# EAGLE design clock (EAGLE 6.5.0)
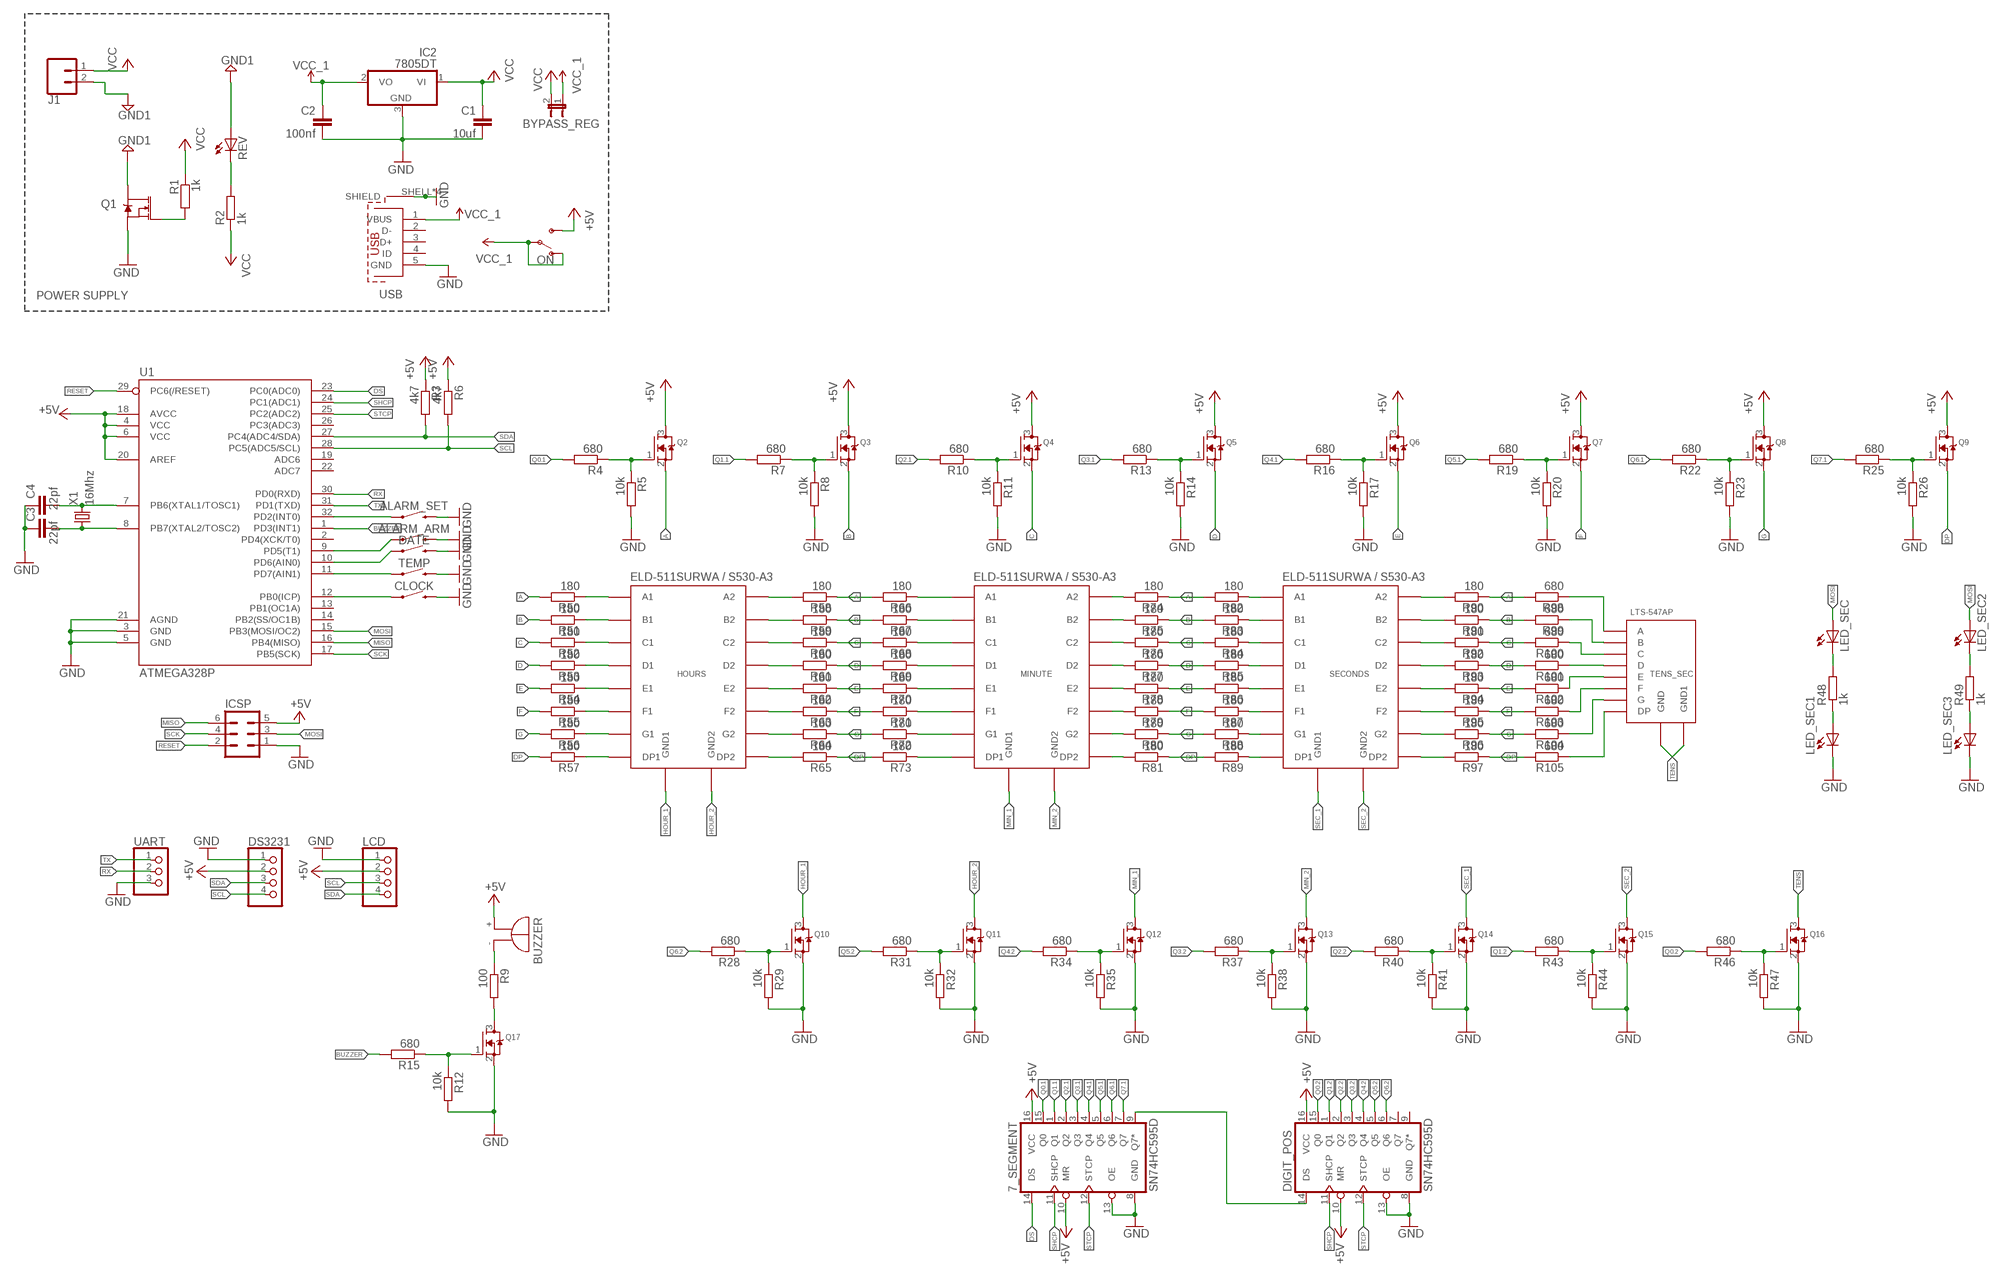
[diagram p0: schematic, sheet 1]

## Parts
7_SEGMENT  SN74HC595D  74HC595D  [SO16]
ALARM_ARM  MOMENTARY-SWITCH-SPST-SMD-5.2MM  [TACTILE_SWITCH_SMD_5.2MM]
ALARM_SET  MOMENTARY-SWITCH-SPST-SMD-5.2MM  [TACTILE_SWITCH_SMD_5.2MM]
BUZZER  EB2209A  [EB2209A]
BYPASS_REG  JUMPER-2PTH  [1X02]
C1  10uf  C-EUC1206  [C1206]
C2  100nf  C-EUC1206  [C1206]
C3  22pf  C-EUC1206  [C1206]
C4  22pf  C-EUC1206  [C1206]
CLOCK  MOMENTARY-SWITCH-SPST-SMD-5.2MM  [TACTILE_SWITCH_SMD_5.2MM]
DATE  MOMENTARY-SWITCH-SPST-SMD-5.2MM  [TACTILE_SWITCH_SMD_5.2MM]
DIGIT_POS  SN74HC595D  74HC595D  [SO16]
DS3231  PINHD-1X4  [1X04]
HOURS  ELD-511SURWA/S530-A3  [2_DIGITS_7_SEGMENT]
IC2  7805DT  [TO252]
ICSP  MA03-2  [MA03-2]
J1  CONN_025MM  [SCREWTERMINAL-5MM-2]
LCD  PINHD-1X4  [1X04]
LED_SEC  LEDSML0805  [SML0805]
LED_SEC1  LEDSML0805  [SML0805]
LED_SEC2  LEDSML0805  [SML0805]
LED_SEC3  LEDSML0805  [SML0805]
MINUTE  ELD-511SURWA/S530-A3  [2_DIGITS_7_SEGMENT]
ON  SWITCH-SPDT-PTH-11.6X4.0MM  [SWITCH_SPDT_PTH_11.6X4.0MM]
Q1  MOSFET-NCH-FDD8780  [DPAK]
Q2  MOSFET-NREFLOW  [SOT23]
Q3  MOSFET-NREFLOW  [SOT23]
Q4  MOSFET-NREFLOW  [SOT23]
Q5  MOSFET-NREFLOW  [SOT23]
Q6  MOSFET-NREFLOW  [SOT23]
Q7  MOSFET-NREFLOW  [SOT23]
Q8  MOSFET-NREFLOW  [SOT23]
Q9  MOSFET-NREFLOW  [SOT23]
Q10  MOSFET-NREFLOW  [SOT23]
Q11  MOSFET-NREFLOW  [SOT23]
Q12  MOSFET-NREFLOW  [SOT23]
Q13  MOSFET-NREFLOW  [SOT23]
Q14  MOSFET-NREFLOW  [SOT23]
Q15  MOSFET-NREFLOW  [SOT23]
Q16  MOSFET-NREFLOW  [SOT23]
Q17  MOSFET-NREFLOW  [SOT23]
R1  1k  R-EU_R0805  [R0805]
R2  1k  R-EU_M0805  [M0805]
R3  4k7  R-EU_M0805  [M0805]
R4  680  R-EU_M0805  [M0805]
R5  10k  R-EU_M0805  [M0805]
R6  4k7  R-EU_M0805  [M0805]
R7  680  R-EU_M0805  [M0805]
R8  10k  R-EU_M0805  [M0805]
R9  100  R-EU_M0805  [M0805]
R10  680  R-EU_M0805  [M0805]
R11  10k  R-EU_M0805  [M0805]
R12  10k  R-EU_M0805  [M0805]
R13  680  R-EU_M0805  [M0805]
R14  10k  R-EU_M0805  [M0805]
R15  680  R-EU_M0805  [M0805]
R16  680  R-EU_M0805  [M0805]
R17  10k  R-EU_M0805  [M0805]
R19  680  R-EU_M0805  [M0805]
R20  10k  R-EU_M0805  [M0805]
R22  680  R-EU_M0805  [M0805]
R23  10k  R-EU_M0805  [M0805]
R25  680  R-EU_M0805  [M0805]
R26  10k  R-EU_M0805  [M0805]
R28  680  R-EU_M0805  [M0805]
R29  10k  R-EU_M0805  [M0805]
R31  680  R-EU_M0805  [M0805]
R32  10k  R-EU_M0805  [M0805]
R34  680  R-EU_M0805  [M0805]
R35  10k  R-EU_M0805  [M0805]
R37  680  R-EU_M0805  [M0805]
R38  10k  R-EU_M0805  [M0805]
R40  680  R-EU_M0805  [M0805]
R41  10k  R-EU_M0805  [M0805]
R43  680  R-EU_M0805  [M0805]
R44  10k  R-EU_M0805  [M0805]
R46  680  R-EU_M0805  [M0805]
R47  10k  R-EU_M0805  [M0805]
R48  1k  R-EU_M0805  [M0805]
R49  1k  R-EU_M0805  [M0805]
R50  180  R-EU_M0805  [M0805]
R51  180  R-EU_M0805  [M0805]
R52  180  R-EU_M0805  [M0805]
R53  180  R-EU_M0805  [M0805]
R54  180  R-EU_M0805  [M0805]
R55  180  R-EU_M0805  [M0805]
R56  180  R-EU_M0805  [M0805]
R57  180  R-EU_M0805  [M0805]
R58  180  R-EU_M0805  [M0805]
R59  180  R-EU_M0805  [M0805]
R60  180  R-EU_M0805  [M0805]
R61  180  R-EU_M0805  [M0805]
R62  180  R-EU_M0805  [M0805]
R63  180  R-EU_M0805  [M0805]
R64  180  R-EU_M0805  [M0805]
R65  180  R-EU_M0805  [M0805]
R66  180  R-EU_M0805  [M0805]
R67  180  R-EU_M0805  [M0805]
R68  180  R-EU_M0805  [M0805]
R69  180  R-EU_M0805  [M0805]
R70  180  R-EU_M0805  [M0805]
R71  180  R-EU_M0805  [M0805]
R72  180  R-EU_M0805  [M0805]
R73  180  R-EU_M0805  [M0805]
R74  180  R-EU_M0805  [M0805]
R75  180  R-EU_M0805  [M0805]
R76  180  R-EU_M0805  [M0805]
R77  180  R-EU_M0805  [M0805]
R78  180  R-EU_M0805  [M0805]
R79  180  R-EU_M0805  [M0805]
R80  180  R-EU_M0805  [M0805]
R81  180  R-EU_M0805  [M0805]
R82  180  R-EU_M0805  [M0805]
R83  180  R-EU_M0805  [M0805]
R84  180  R-EU_M0805  [M0805]
R85  180  R-EU_M0805  [M0805]
R86  180  R-EU_M0805  [M0805]
R87  180  R-EU_M0805  [M0805]
R88  180  R-EU_M0805  [M0805]
R89  180  R-EU_M0805  [M0805]
R90  180  R-EU_M0805  [M0805]
R91  180  R-EU_M0805  [M0805]
R92  180  R-EU_M0805  [M0805]
R93  180  R-EU_M0805  [M0805]
R94  180  R-EU_M0805  [M0805]
R95  180  R-EU_M0805  [M0805]
R96  180  R-EU_M0805  [M0805]
R97  180  R-EU_M0805  [M0805]
R98  680  R-EU_M0805  [M0805]
R99  680  R-EU_M0805  [M0805]
R100  680  R-EU_M0805  [M0805]
R101  680  R-EU_M0805  [M0805]
R102  680  R-EU_M0805  [M0805]
R103  680  R-EU_M0805  [M0805]
R104  680  R-EU_M0805  [M0805]
R105  680  R-EU_M0805  [M0805]
REV  LEDSML0805  [SML0805]
SECONDS  ELD-511SURWA/S530-A3  [2_DIGITS_7_SEGMENT]
TEMP  MOMENTARY-SWITCH-SPST-SMD-5.2MM  [TACTILE_SWITCH_SMD_5.2MM]
TENS_SEC  LTS-547AP  [LTS-547AP]
U1  ATMEGA328P  ATMEGA328P_TQFP  [TQFP32-08]
UART  PINHD-1X3  [1X03]
USB  629105136821  [629105136821]
X1  16Mhz  CRYSTALSM49  [SM49]

## Nets
+5V: 7_SEGMENT.10(MR) 7_SEGMENT.16(VCC) BUZZER.+ DIGIT_POS.10(MR) DIGIT_POS.16(VCC) DS3231.2 ICSP.5 LCD.2 ON.3(S) Q2.3(D) Q3.3(D) Q4.3(D) Q5.3(D) Q6.3(D) Q7.3(D) Q8.3(D) Q9.3(D) R3.1 R6.1 U1.4(VCC) U1.6(VCC) U1.18(AVCC) U1.20(AREF)
A: Q2.2(S) R50.2 R58.1 R66.2 R74.1 R82.2 R90.1 R98.2
B: Q3.2(S) R51.2 R59.1 R67.2 R75.1 R83.2 R91.1 R99.2
BUZZER: R15.2 U1.1(PD3(INT1))
C: Q4.2(S) R52.2 R60.1 R68.2 R76.1 R84.2 R92.1 R100.2
D: Q5.2(S) R53.2 R61.1 R69.2 R77.1 R85.2 R93.1 R101.2
DP: Q9.2(S) R57.2 R65.1 R73.2 R81.1 R89.2 R97.1 R105.2
DS: 7_SEGMENT.14(DS) U1.23(PC0(ADC0))
E: Q6.2(S) R54.2 R62.1 R70.2 R78.1 R86.2 R94.1 R102.2
F: Q7.2(S) R55.2 R63.1 R71.2 R79.1 R87.2 R95.1 R103.2
G: Q8.2(S) R56.2 R64.1 R72.2 R80.1 R88.2 R96.1 R104.2
GND: 7_SEGMENT.8(GND) 7_SEGMENT.13(OE) ALARM_ARM.3 ALARM_SET.3 C1.2 C2.2 C3.1 C4.1 CLOCK.3 DATE.3 DIGIT_POS.8(GND) DIGIT_POS.13(OE) DS3231.1 IC2.3(GND) ICSP.1 LCD.1 LED_SEC1.C LED_SEC3.C Q1.3(S) Q10.2(S) Q11.2(S) Q12.2(S) Q13.2(S) Q14.2(S) Q15.2(S) Q16.2(S) Q17.2(S) R5.2 R8.2 R11.2 R12.2 R14.2 R17.2 R20.2 R23.2 R26.2 R29.2 R32.2 R35.2 R38.2 R41.2 R44.2 R47.2 TEMP.3 U1.3(GND) U1.5(GND) U1.21(AGND) UART.3 USB.5(GND) USB.SHELL1(SHIELD) USB.SHELL2(SHIELD) USB.SHELL3(SHIELD) USB.SHELL(SHIELD)
GND1: J1.2 Q1.4(D) REV.A
HOUR_1: HOURS.GND1 Q10.3(D)
HOUR_2: HOURS.GND2 Q11.3(D)
MIN_1: MINUTE.GND1 Q12.3(D)
MIN_2: MINUTE.GND2 Q13.3(D)
MISO: ICSP.6 U1.16(PB4(MISO))
MOSI: ICSP.3 LED_SEC2.A LED_SEC.A U1.15(PB3(MOSI/OC2))
N$1: Q1.1(G) R1.2
N$2: LED_SEC.C R48.2
N$3: C4.2 U1.7(PB6(XTAL1/TOSC1)) X1.2
N$4: C3.2 U1.8(PB7(XTAL2/TOSC2)) X1.1
N$5: 7_SEGMENT.9(Q7*) DIGIT_POS.14(DS)
N$6: Q2.1(G) R4.1 R5.1
N$7: R2.2 REV.C
N$8: Q3.1(G) R7.1 R8.1
N$9: Q4.1(G) R10.1 R11.1
N$10: Q5.1(G) R13.1 R14.1
N$11: Q6.1(G) R16.1 R17.1
N$12: Q7.1(G) R19.1 R20.1
N$13: Q8.1(G) R22.1 R23.1
N$14: Q9.1(G) R25.1 R26.1
N$15: Q10.1(G) R28.1 R29.1
N$16: CLOCK.1 U1.12(PB0(ICP))
N$17: TEMP.1 U1.11(PD7(AIN1))
N$18: DATE.1 U1.10(PD6(AIN0))
N$19: Q11.1(G) R31.1 R32.1
N$20: LED_SEC1.A R48.1
N$21: LED_SEC2.C R49.2
N$22: Q17.1(G) R12.1 R15.1
N$23: Q12.1(G) R34.1 R35.1
N$24: LED_SEC3.A R49.1
N$25: ALARM_SET.1 U1.32(PD2(INT0))
N$26: HOURS.A1 R50.1
N$27: Q13.1(G) R37.1 R38.1
N$28: HOURS.B1 R51.1
N$29: ALARM_ARM.1 U1.9(PD5(T1))
N$30: HOURS.C1 R52.1
N$31: Q14.1(G) R40.1 R41.1
N$32: HOURS.D1 R53.1
N$33: HOURS.E1 R54.1
N$34: HOURS.F1 R55.1
N$35: Q15.1(G) R43.1 R44.1
N$36: HOURS.G1 R56.1
N$37: HOURS.DP1 R57.1
N$38: HOURS.A2 R58.2
N$39: Q16.1(G) R46.1 R47.1
N$40: HOURS.B2 R59.2
N$41: HOURS.C2 R60.2
N$42: HOURS.D2 R61.2
N$43: HOURS.E2 R62.2
N$44: HOURS.F2 R63.2
N$45: HOURS.G2 R64.2
N$46: HOURS.DP2 R65.2
N$47: MINUTE.A2 R74.2
N$48: MINUTE.A1 R66.1
N$49: MINUTE.B1 R67.1
N$50: MINUTE.C1 R68.1
N$51: MINUTE.B2 R75.2
N$52: MINUTE.C2 R76.2
N$53: MINUTE.D2 R77.2
N$54: MINUTE.E2 R78.2
N$55: MINUTE.F2 R79.2
N$56: MINUTE.G2 R80.2
N$57: MINUTE.DP2 R81.2
N$58: MINUTE.DP1 R73.1
N$59: MINUTE.G1 R72.1
N$60: MINUTE.F1 R71.1
N$61: MINUTE.E1 R70.1
N$62: MINUTE.D1 R69.1
N$63: Q17.3(D) R9.2
N$64: BUZZER.- R9.1
N$65: R89.1 SECONDS.DP1
N$66: R88.1 SECONDS.G1
N$67: R87.1 SECONDS.F1
N$68: R86.1 SECONDS.E1
N$75: R82.1 SECONDS.A1
N$76: R83.1 SECONDS.B1
N$77: R84.1 SECONDS.C1
N$78: R85.1 SECONDS.D1
N$79: R90.2 SECONDS.A2
N$80: R91.2 SECONDS.B2
N$81: R92.2 SECONDS.C2
N$82: R93.2 SECONDS.D2
N$83: R94.2 SECONDS.E2
N$84: R95.2 SECONDS.F2
N$85: R96.2 SECONDS.G2
N$86: R97.2 SECONDS.DP2
N$95: R98.1 TENS_SEC.A
N$96: R99.1 TENS_SEC.B
N$97: R100.1 TENS_SEC.C
N$98: R101.1 TENS_SEC.D
N$99: R102.1 TENS_SEC.E
N$100: R103.1 TENS_SEC.F
N$101: R104.1 TENS_SEC.G
N$102: R105.1 TENS_SEC.DP
Q0.1: 7_SEGMENT.15(Q0) R4.2
Q0.2: DIGIT_POS.15(Q0) R46.2
Q1.1: 7_SEGMENT.1(Q1) R7.2
Q1.2: DIGIT_POS.1(Q1) R43.2
Q2.1: 7_SEGMENT.2(Q2) R10.2
Q2.2: DIGIT_POS.2(Q2) R40.2
Q3.1: 7_SEGMENT.3(Q3) R13.2
Q3.2: DIGIT_POS.3(Q3) R37.2
Q4.1: 7_SEGMENT.4(Q4) R16.2
Q4.2: DIGIT_POS.4(Q4) R34.2
Q5.1: 7_SEGMENT.5(Q5) R19.2
Q5.2: DIGIT_POS.5(Q5) R31.2
Q6.1: 7_SEGMENT.6(Q6) R22.2
Q6.2: DIGIT_POS.6(Q6) R28.2
Q7.1: 7_SEGMENT.7(Q7) R25.2
RESET: ICSP.2 U1.29(PC6(/RESET))
RX: U1.30(PD0(RXD)) UART.2
SCK: ICSP.4 U1.17(PB5(SCK))
SCL: DS3231.4 LCD.3 R6.2 U1.28(PC5(ADC5/SCL))
SDA: DS3231.3 LCD.4 R3.2 U1.27(PC4(ADC4/SDA))
SEC_1: Q14.3(D) SECONDS.GND1
SEC_2: Q15.3(D) SECONDS.GND2
SHCP: 7_SEGMENT.11(SHCP) DIGIT_POS.11(SHCP) U1.24(PC1(ADC1))
STCP: 7_SEGMENT.12(STCP) DIGIT_POS.12(STCP) U1.25(PC2(ADC2))
TENS: Q16.3(D) TENS_SEC.GND TENS_SEC.GND1
TX: U1.31(PD1(TXD)) UART.1
VCC: BYPASS_REG.2 C1.1 IC2.1(VI) J1.1 R1.1 R2.1
VCC_1: BYPASS_REG.1 C2.1 IC2.2(VO) ON.1(O) ON.2(P) USB.1(VBUS)
Unconnected: DIGIT_POS.7(Q7) DIGIT_POS.9(Q7*) U1.2(PD4(XCK/T0)) U1.13(PB1(OC1A)) U1.14(PB2(SS/OC1B)) U1.19(ADC6) U1.22(ADC7) U1.26(PC3(ADC3)) USB.2(D-) USB.3(D+) USB.4(ID)

## Notes on the sheet
- POWER SUPPLY

## Library data of the parts
7_SEGMENT DIGIT_POS = SparkFun-IC-Logic:74*595: 8-Bit Shift Register (Serial to Parallel) Datasheet <http://cdn.sparkfun.com/datasheets/BreakoutBoards/MM74HC595.pdf> SparkFun Products SparkFun Shift Register Breakout - 74HC595 <https://www.sparkfun.com/products/10680> (BOB-10680); PROD_ID: IC-07875
ALARM_ARM ALARM_SET CLOCK DATE TEMP = SparkFun-Switches:MOMENTARY-SWITCH-SPST: Momentary Switch (Pushbutton) - SPST Normally-open (NO) SPST momentary switches (buttons, pushbuttons). Variants PTH-12MM - 12mm square, through-hole Momentary Pushbutton Switch - 12mm Square <https://www.sparkfun.com/products/9190> (COM-09190) PTH-6.0MM, PTH-6.0MM-KIT - 6.0mm square, through-hole Mini Pushbutton Switch <https://www.sparkfun.com/products/97> (COM-00097) KIT package intended for soldering kit's - only one side of pads' copper is exposed. PTH-RIGHT-ANGLE-KIT - Right-angle, through-hole Right Angle Tactile Button <https://www.sparkfun.com/products/10791> - Used on SparkFun BigTime Watch Kit <https://www.sparkfun.com/products/11734> SMD-12MM - 12mm square, surface-mount Tactile Button - SMD (12mm) <https://www.sparkfun.com/products/12993> (COM-12993) Used on SparkFun PicoBoard <https://www.sparkfun.com/products/11888> SMD-4.5MM - 4.5mm Square Trackball Switch Used on SparkFun Blackberry Trackballer Breakout <https://www.sparkfun.com/products/13169> SMD-4.6MMX2.8MM - 4.60mm x 2.80mm, surface mount Used on SparkFun SAMD21 Mini Breakout <https://www.sparkfun.com/products/13664> SMD-5.2MM, SMD-5.2-REDUNDANT - 5.2mm square, surface-mount Mini Pushbutton Switch - SMD <https://www.sparkfun.com/products/8720> (COM-08720) Used on Arduino Pro Mini <https://www.sparkfun.com/products/11114> REDUNDANT package connects both switch circuits together SMD-6.0X3.5MM - 6.0 x 3.5mm, surface mount Momentary Reset Switch SMD <https://www.sparkfun.com/products/8229> (COM-08229) SMD-6.2MM-TALL - 6.2mm square, surface mount Tactile Button - SMD (6mm) <https://www.sparkfun.com/products/12992> Used on SparkFun Digital Sandbox <https://www.sparkfun.com/products/12651> SMD-RIGHT-ANGLE - Right-angle, surface mount Used on SparkFun Block for Intel® Edison - Arduino <https://www.sparkfun.com/products/13036>; PROD_ID: SWCH-08247; SF_SKU: COM-08720
BUZZER = buzzer:EB2209A: BUZZER Source: Buerklin; OC_FARNELL: unknown; OC_NEWARK: unknown
BYPASS_REG = SparkFun-Retired:JUMPER-2: Jumper Basic 0.1" spaced jumper. Use with breakaway headers.
C1-C4 = rcl:C-EU: CAPACITOR, European symbol
DS3231 LCD = pinhead:PINHD-1X4: PIN HEADER
HOURS MINUTE SECONDS = 7segment-display:ELD-511SURWA/S530-A3
IC2 = adafruit:78*: Positive VOLTAGE REGULATOR Added bigger pads to the TO-92 package
ICSP = con-lstb:MA03-2: PIN HEADER; OC_FARNELL: unknown; OC_NEWARK: unknown
J1 = SparkFun-Connectors:CONN_02: Multi connection point. Often used as Generic Header-pin footprint for 0.1 inch spaced/style header connections On any of the 0.1 inch spaced packages, you can populate with these: Break Away Headers - Straight <https://www.sparkfun.com/products/116> (PRT-00116) Break Away Male Headers - Right Angle <https://www.sparkfun.com/products/553> (PRT-00553) Female Headers <https://www.sparkfun.com/products/115> (PRT-00115) Break Away Headers - Machine Pin <https://www.sparkfun.com/products/117> (PRT-00117) Break Away Female Headers - Swiss Machine Pin <https://www.sparkfun.com/products/743> (PRT-00743) For SCREWTERMINALS and SPRING TERMINALS visit here: Screw Terimnals on SparkFun.com <https://www.sparkfun.com/search/results?term=Screw+Terminals> (5mm/3.5mm/2.54mm spacing) This device is also useful as a general connection point to wire up your design to another part of your project. Our various solder wires solder well into these plated through hole pads. Hook-Up Wire - Assortment (Stranded, 22 AWG) <https://www.sparkfun.com/products/11375> (PRT-11375) Hook-Up Wire - Assortment (Solid Core, 22 AWG) <https://www.sparkfun.com/products/11367> (PRT-11367) View the entire wire category on our website here <https://www.sparkfun.com/categories/141> Special notes: Molex polarized connector foot print use with: PRT-08233 with associated crimp pins and housings. 2.54_SCREWTERM for use with PRT-10571. 3.5mm Screw Terminal footprints for PRT-08084 5mm Screw Terminal footprints for use with PRT-08432; SF_SKU: PRT-08432
LED_SEC LED_SEC1-LED_SEC3 REV = led:LED: LED OSRAM: - CHIPLED LG R971, LG N971, LY N971, LG Q971, LY Q971, LO R971, LY R971 LH N974, LH R974 LS Q976, LO Q976, LY Q976 LO Q996 - Hyper CHIPLED LW Q18S LB Q993, LB Q99A, LB R99A - SideLED LS A670, LO A670, LY A670, LG A670, LP A670 LB A673, LV A673, LT A673, LW A673 LH A674 LY A675 LS A676, LA A676, LO A676, LY A676, LW A676 LS A679, LY A679, LG A679 - Hyper Micro SIDELED® LS Y876, LA Y876, LO Y876, LY Y876 LT Y87S - SmartLED LW L88C, LW L88S LB L89C, LB L89S, LG L890 LS L89K, LO L89K, LY L89K LS L896, LA L896, LO L896, LY L896 - TOPLED LS T670, LO T670, LY T670, LG T670, LP T670 LSG T670, LSP T670, LSY T670, LOP T670, LYG T670 LG T671, LOG T671, LSG T671 LB T673, LV T673, LT T673, LW T673 LH T674 LS T676, LA T676, LO T676, LY T676, LB T676, LH T676, LSB T676, LW T676 LB T67C, LV T67C, LT T67C, LS T67K, LO T67K, LY T67K, LW E67C LS E67B, LA E67B, LO E67B, LY E67B, LB E67C, LV E67C, LT E67C LW T67C LS T679, LY T679, LG T679 LS T770, LO T770, LY T770, LG T770, LP T770 LB T773, LV T773, LT T773, LW T773 LH T774 LS E675, LA E675, LY E675, LS T675 LS T776, LA T776, LO T776, LY T776, LB T776 LHGB T686 LT T68C, LB T68C - Hyper Mini TOPLED® LB M676 - Mini TOPLED Santana® LG M470 LS M47K, LO M47K, LY M47K Source: http://www.osram.convergy.de LUXEON: - LUMILED® LXK2-PW12-R00, LXK2-PW12-S00, LXK2-PW14-U00, LXK2-PW14-V00 LXK2-PM12-R00, LXK2-PM12-S00, LXK2-PM14-U00 LXK2-PE12-Q00, LXK2-PE12-R00, LXK2-PE12-S00, LXK2-PE14-T00, LXK2-PE14-U00 LXK2-PB12-K00, LXK2-PB12-L00, LXK2-PB12-M00, LXK2-PB14-N00, LXK2-PB14-P00, LXK2-PB14-Q00 LXK2-PR12-L00, LXK2-PR12-M00, LXK2-PR14-Q00, LXK2-PR14-R00 LXK2-PD12-Q00, LXK2-PD12-R00, LXK2-PD12-S00 LXK2-PH12-R00, LXK2-PH12-S00 LXK2-PL12-P00, LXK2-PL12-Q00, LXK2-PL12-R00 Source: www.luxeon.com KINGBRIGHT: KA-3528ASYC Source: www.kingbright.com
ON = SparkFun-Switches:SWITCH-SPDT: Single Pole, Double Throw (SPDT) Switch Single-pole, double-throw (SPDT) switch. Variant Overview SMD-AYZ0202 Surface Mount DPDT Switch <https://www.sparkfun.com/products/597> (COM-00597) Used on e.g. LilyPad Arduino USB - ATmega32U4 Board <https://www.sparkfun.com/products/12049> PTH-11.6X4.0MM SPDT Mini Power Switch <https://www.sparkfun.com/products/102> (COM-00102) Used on e.g. SparkFun Simon Says - Through-Hole Soldering Kit <https://www.sparkfun.com/products/10547> (KIT-10547) PTH-11.6X4.0MM-KIT KIT version of SPDT Mini Power Switch - Simplifies soldering by removing tStop of switch pins - only one side can be soldered. PTH-11.6X4.0MM-LOCK LOCK version of SPDT Mini Power Switch - Offset pins hold switch in place for easier soldering. SMD-RIGHT-ANGLE Surface Mount Right Angle Switch <https://www.sparkfun.com/products/10860> (COM-10860) Used on e.g. SparkFun ESP8266 Thing <https://www.sparkfun.com/products/13231>; PROD_ID: SWCH-08261; SF_SKU: COM-00102
Q1 = SparkFun-DiscreteSemi:MOSFET-NCH: N-channel MOSFETs Voltage controlled devices that allow control of high current outputs. SparkFun Products: SparkFun OpenScale <https://www.sparkfun.com/products/13261> SparkFun Digital Sandbox <https://www.sparkfun.com/products/12651> SparkFun Monster Moto Shield <https://www.sparkfun.com/products/10182> SparkFun MOSFET Power Controller <https://www.sparkfun.com/products/11214>; PROD_ID: TRANS-09984; VALUE: 35A/25V/8.5mΩ
Q2-Q17 = adafruit:MOSFET-N: N-Channel Mosfet 2N7002E - 60V 260mA SOT23 [Digikey: 2N7002ET1GOSTR-ND] - REEL BSH103 - 30V 850mA SOT23 [Digikey: 568-5013-1-ND]
R1-R17 R19 R20 R22 R23 R25 R26 R28 R29 R31 R32 R34 R35 R37 R38 R40 R41 R43 R44 R46-R105 = rcl:R-EU_: RESISTOR, European symbol
TENS_SEC = 7segment-display:LTS-547AP
U1 = SparkFun-IC-Microcontroller:ATMEGA328P_TQFP: Popular 328P in QFP Storefront component: ATmega328 - TQFP <https://www.sparkfun.com/products/13448> (COM-13448) Datasheet <http://www.sparkfun.com/datasheets/Components/SMD/ATMega328.pdf> SparkFun Products SparkFun RedBoard - Programmed with Arduino <https://www.sparkfun.com/products/12757> (DEV-12757) Arduino Pro Mini 328 - 5V/16MHz <https://www.sparkfun.com/products/11113> (DEV-11113) Arduino Pro Mini 328 - 3.3V/8MHz <https://www.sparkfun.com/products/11114> (DEV-11114) SparkFun OpenLog <https://www.sparkfun.com/products/13712> (DEV-13712) SparkFun MicroView - OLED Arduino Module <https://www.sparkfun.com/products/12923> (DEV-12923) SparkFun Digital Sandbox <https://www.sparkfun.com/products/12651> (DEV-12651) SparkFun PicoBoard <https://www.sparkfun.com/products/11888> (WIG-11888) Arduino Fio <https://www.sparkfun.com/products/10116> (DEV-10116) LilyPad Arduino 328 Main Board <https://www.sparkfun.com/products/13342> (DEV-13342) SparkFun RedStick <https://www.sparkfun.com/products/13741> (DEV-13741) LilyPad MP3 <https://www.sparkfun.com/products/11013> (DEV-11013) LilyPad Arduino SimpleSnap <https://www.sparkfun.com/products/10941> (DEV-10941) SparkFun Stepoko <https://www.sparkfun.com/products/13899> (ROB-13899) SparkFun Geiger Counter <https://www.sparkfun.com/products/11345> (SEN-11345) SparkFun EL Sequencer <https://www.sparkfun.com/products/12781> (COM-12781) Arduino Pro 328 - 5V/16MHz <https://www.sparkfun.com/products/10915> (DEV-10915) CryptoCape <https://www.sparkfun.com/products/12773> (DEV-12773) SparkFun IR Thermometer Evaluation Board - MLX90614 <https://www.sparkfun.com/products/10740> (SEN-10740) SparkFun RedBot Mainboard <https://www.sparkfun.com/products/12097> (ROB-12097) Arduino Pro 328 - 3.3V/8MHz <https://www.sparkfun.com/products/10914> (DEV-10914) SparkFun Block for Intel® Edison - Arduino <https://www.sparkfun.com/products/13036> (DEV-13036) SparkFun Simon Says - Surface Mount Soldering Kit <https://www.sparkfun.com/products/10935> (KIT-10935) SparkFun 7-Segment Serial Display - Red <https://www.sparkfun.com/products/11441> (COM-11441) SparkFun 7-Segment Serial Display - White <https://www.sparkfun.com/products/11629> (COM-11629) SparkFun 7-Segment Serial Display - Yellow <https://www.sparkfun.com/products/11443> (COM-11443) SparkFun 7-Segment Serial Display - Kelly Green <https://www.sparkfun.com/products/11440> (COM-11440) SparkFun 7-Segment Serial Display - Blue <https://www.sparkfun.com/products/11442> (COM-11442) SparkFun OpenSegment Serial Display - 20mm (Blue) <https://www.sparkfun.com/products/11647> (COM-11647) SparkFun OpenSegment Serial Display - 20mm (Green) <https://www.sparkfun.com/products/11646> (COM-11646) SparkFun OpenSegment Serial Display - 20mm (White) <https://www.sparkfun.com/products/11648> (COM-11648) SparkFun OpenSegment Serial Display - 20mm (Red) <https://www.sparkfun.com/products/11644> (COM-11644) SparkFun OpenSegment Serial Display - 20mm (Yellow) <https://www.sparkfun.com/products/11645> (COM-11645) SparkFun OpenSegment Shield <https://www.sparkfun.com/products/13190> (DEV-13190); PROD_ID: IC-09069; VALUE: ATMEGA328P_TQFP
UART = pinhead:PINHD-1X3: PIN HEADER
USB = usb connector:629105136821: WR-COM SMT Horizontal 5 Contacts Micro USB Type B,5 pins=>Code : Con_I-O_COM_MicroUSB_629105136821 <http://katalog.we-online.de/media/images/eican/Con_I-O_COM_MicroUSB_629105136821_pf2.jpg> Details see: http://katalog.we-online.de/en/em/COM_MICRO_SMT_TYPE_B_HORIZONTAL/629105136821?m Created 2014-07-09, Karrer Zheng 2014 (C) Würth Elektronik
X1 = crystal:CRYSTAL: CRYSTAL; OC_FARNELL: unknown; OC_NEWARK: unknown

## Board
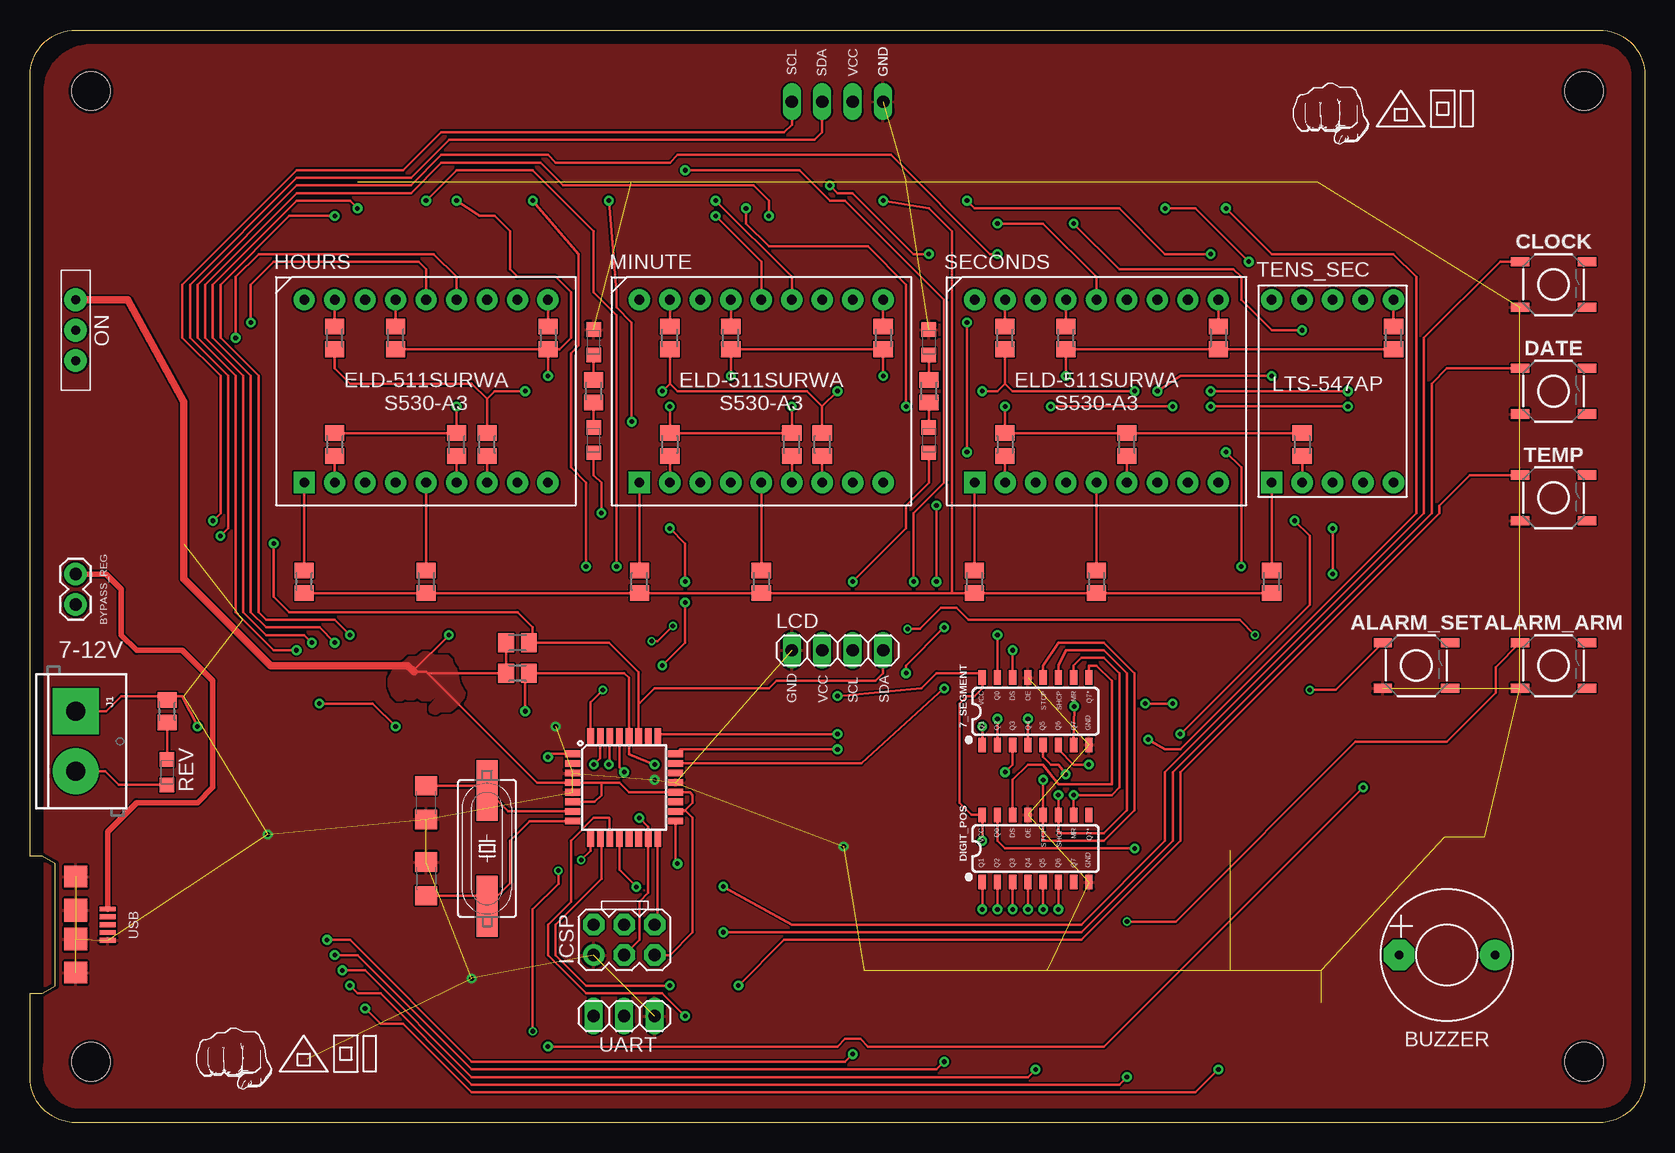
[diagram p1: board, top side]
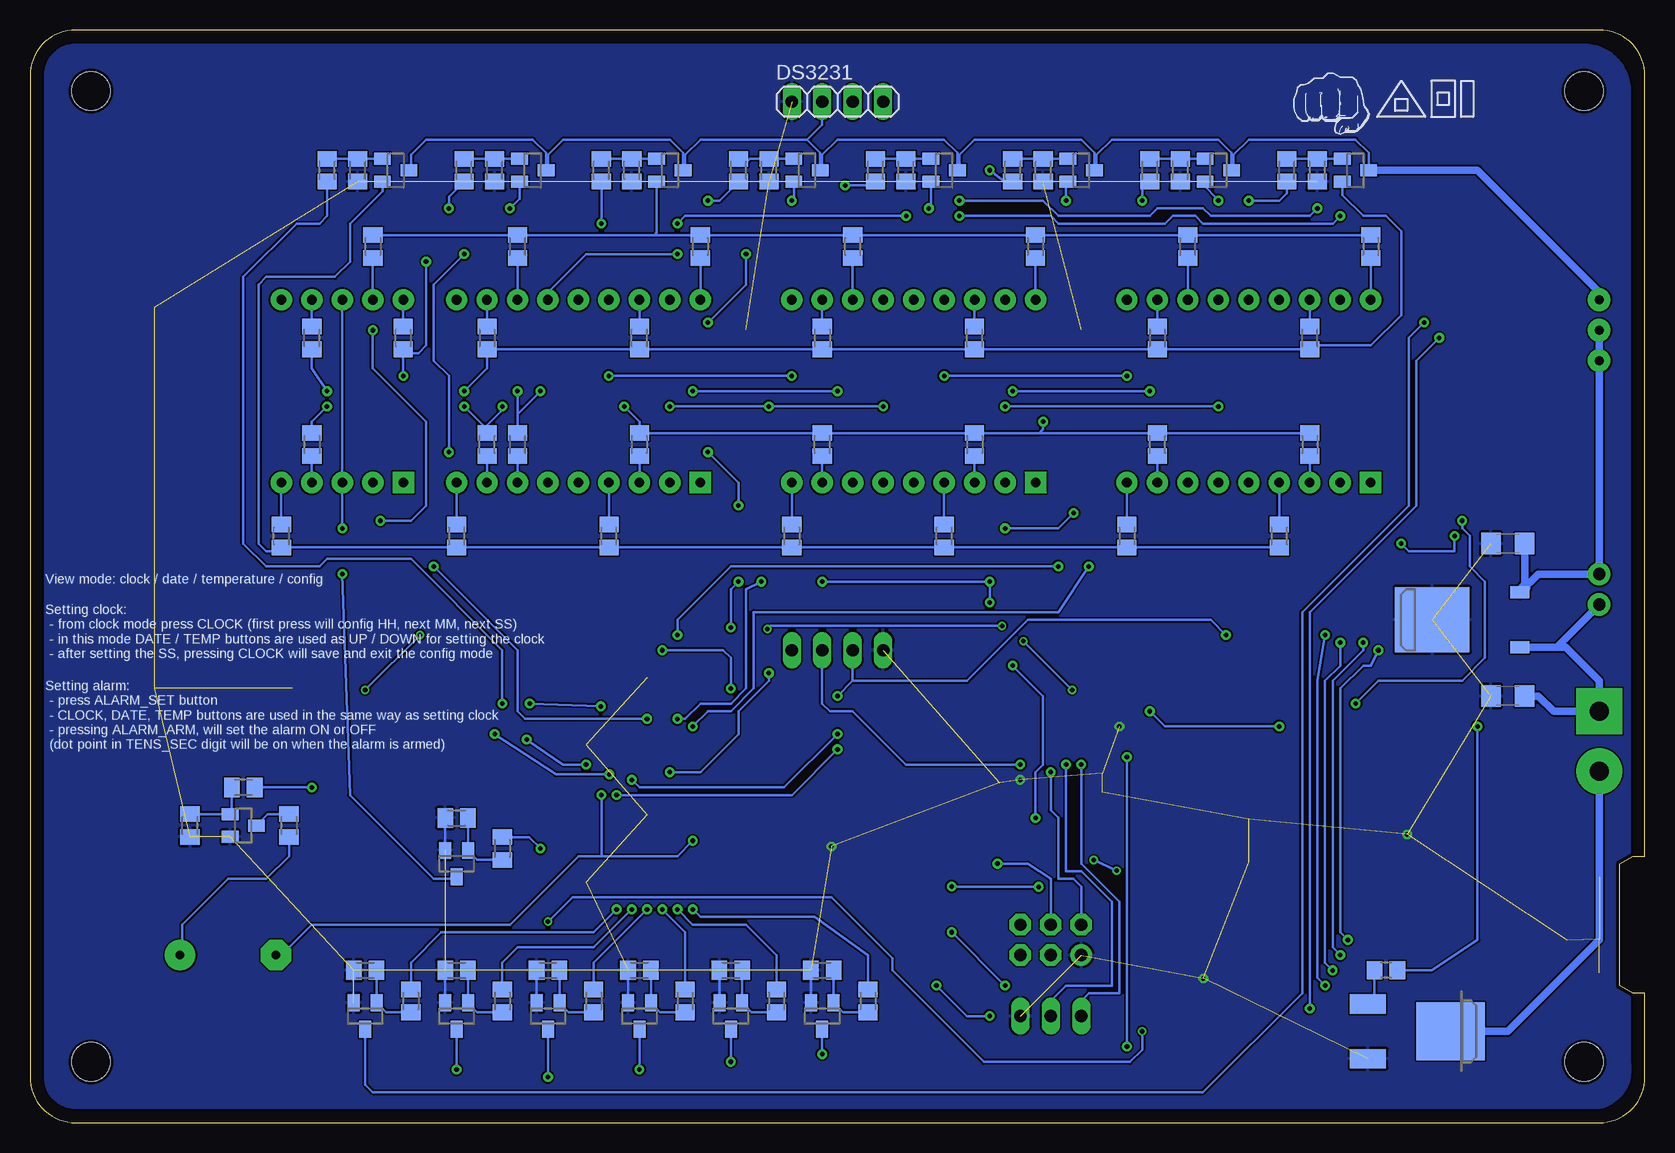
[diagram p2: board, bottom side, seen from below]

Size 134.62 x 91.06 mm. Coordinates in mm from the lower left corner, seen from the top.
Outline: 3.81,0 arc-90 0,3.81 0,10.8 1,10.8 2.1,11.4 2.1,21.6 1,22.2 0,22.2 0,87.25 arc-90 3.81,91.06 130.81,91.06 arc-90 134.62,87.25 134.62,3.81 arc-90 130.81,0 3.81,0
Copper layers (1*16): Top 0.035mm / dielectric 1.5mm / Bottom 0.035mm
Design rules "SeeedStudio_2layer_DRU_no_angle_20140221 *": minimum track width 6mil, minimum drill 12mil, track to track 6mil, track to pad 6mil, pad to pad 6mil, via to via 6mil, smd to smd 0mil, copper to edge 10mil, drill to drill 10mil, minimum pad ring 10mil, minimum via ring 6mil, stop-mask expansion 2mil, vias tented up to drill 20mil, thermal gap 8mil
Holes 3.2 mm at 5.08,5.08 5.08,85.98 129.54,85.98 129.54,5.08

### Footprints (pad centres in the part's own frame; a part is rotated, then mirrored left to right if it is on the bottom)
SO16 = smd 0.6 x 1.2: 1 -4.445,-2.8; 2 -3.175,-2.8; 3 -1.905,-2.8; 4 -0.635,-2.8; 5 0.635,-2.8; 6 1.905,-2.8; 7 3.175,-2.8; 8 4.445,-2.8; 9 4.445,2.8; 10 3.175,2.8; 11 1.905,2.8; 12 0.635,2.8; 13 -0.635,2.8; 14 -1.905,2.8; 15 -3.175,2.8; 16 -4.445,2.8
TACTILE_SWITCH_SMD_5.2MM = smd 1.524 x 0.762: 1 -2.794,1.905; 2 2.794,1.905; 3 -2.794,-1.905; 4 2.794,-1.905
EB2209A = drill 0.7 pad 2.54 octagon: + 4,0 | drill 0.7 pad 2.54: - -4,0
1X02 = drill 1.016 pad 1.88: 1 0,0; 2 2.54,0
C1206 = smd 1.6 x 1.8: 1 -1.4,0; 2 1.4,0
1X04 = drill 1.016 long: 1 -3.81,0; 2 -1.27,0; 3 1.27,0; 4 3.81,0
2_DIGITS_7_SEGMENT = drill 0.8 pad 1.778: A1 -5.08,7.62; A2 7.62,7.62; B1 -2.54,7.62; B2 10.16,7.62; C1 -5.08,-7.62; C2 7.62,-7.62; D1 -7.62,-7.62; D2 2.54,-7.62; DP1 -2.54,-7.62; DP2 10.16,-7.62; E2 0,-7.62; F1 -10.16,7.62; F2 5.08,7.62; G1 -7.62,7.62; G2 5.08,-7.62; GND1 0,7.62; GND2 2.54,7.62 | drill 0.8 pad 1.778 square: E1 -10.16,-7.62
TO252 = smd 1 x 1.6: 1 -2.28,-4.8; 2 2.28,-4.8 | smd 5.4 x 6.2: 3 0,2.5
MA03-2 = drill 1.016 pad 1.778: 1 -2.54,-1.27 | drill 1.016 pad 1.778 octagon: 2 -2.54,1.27; 3 0,-1.27; 4 0,1.27; 5 2.54,-1.27; 6 2.54,1.27
SCREWTERMINAL-5MM-2 = drill 1.6 pad 3.81 square: 1 0,0 | drill 1.6 pad 3.81: 2 5,0
SML0805 = smd 1.2 x 1.2: A 1.05,0; C -1.05,0
SWITCH_SPDT_PTH_11.6X4.0MM = drill 0.762 pad 1.88: 1 0,2.54; 2 0,0; 3 0,-2.54
DPAK = smd 1.6 x 3: 1 -2.28,-5.31; 3 2.28,-5.31 | smd 4.826 x 5.715: 4 0,1.588
SOT23 = smd 1 x 1.4: 1 -0.95,-1.1; 2 0.95,-1.1; 3 0,1.1
R0805 = smd 1.3 x 1.5: 1 -0.95,0; 2 0.95,0
M0805 = smd 1.3 x 1.6: 1 -0.95,0; 2 0.95,0
LTS-547AP = drill 0.8 pad 1.778: A 2.54,7.62; B 5.08,7.62; C 2.54,-7.62; D -2.54,-7.62; DP 5.08,-7.62; F -2.54,7.62; G -5.08,7.62; GND 0,-7.62; GND1 0,7.62 | drill 0.8 pad 1.778 square: E -5.08,-7.62
TQFP32-08 = smd 1.27 x 0.559: 1 -4.293,2.8; 2 -4.293,2; 3 -4.293,1.2; 4 -4.293,0.4; 5 -4.293,-0.4; 6 -4.293,-1.2; 7 -4.293,-2; 8 -4.293,-2.8; 17 4.293,-2.8; 18 4.293,-2; 19 4.293,-1.2; 20 4.293,-0.4; 21 4.293,0.4; 22 4.293,1.2; 23 4.293,2; 24 4.293,2.8 | smd 0.559 x 1.27: 9 -2.8,-4.293; 10 -2,-4.293; 11 -1.2,-4.293; 12 -0.4,-4.293; 13 0.4,-4.293; 14 1.2,-4.293; 15 2,-4.293; 16 2.8,-4.293; 25 2.8,4.293; 26 2,4.293; 27 1.2,4.293; 28 0.4,4.293; 29 -0.4,4.293; 30 -1.2,4.293; 31 -2,4.293; 32 -2.8,4.293
1X03 = drill 1.016 long: 1 -2.54,0; 2 0,0; 3 2.54,0
629105136821 = smd 0.4 x 1.35: 1 -1.3,2.675; 2 -0.65,2.675; 3 0,2.675; 4 0.65,2.675; 5 1.3,2.675 | smd 1.8 x 1.9: SHELL -4,0; SHELL3 4,0 | smd 1.9 x 1.9: SHELL1 -1.2,0; SHELL2 1.2,0
SM49 = smd 5.08 x 1.778: 1 -4.826,0; 2 4.826,0

### Placement (x,y rotation side)
7_SEGMENT  83.82,34.29 0 top
ALARM_ARM  127,38.1 0 top
ALARM_SET  115.57,38.1 0 top
BUZZER  118.11,13.97 180 top
BYPASS_REG  3.81,45.72 270 top
C1  11.43,35.56 180 bottom
C2  11.43,48.26 180 bottom
C3  33.02,20.32 270 top
C4  33.02,26.67 90 top
CLOCK  127,69.85 0 top
DATE  127,60.96 0 top
DIGIT_POS  83.82,22.86 0 top
DS3231  67.31,85.09 0 bottom
HOURS  33.02,60.96 0 top
IC2  15.24,41.91 90 bottom
ICSP  49.53,15.24 0 top
J1  3.81,34.29 270 top
LCD  67.31,39.37 0 top
LED_SEC  46.99,56.88 270 top
LED_SEC1  46.99,65.04 270 top
LED_SEC2  74.93,56.88 270 top
LED_SEC3  74.93,65.04 270 top
MINUTE  60.96,60.96 0 top
ON  3.81,66.04 180 top
Q1  17.78,7.62 270 bottom
Q2  24.13,79.38 270 bottom
Q3  35.56,79.38 270 bottom
Q4  46.99,79.38 270 bottom
Q5  58.42,79.38 270 bottom
Q6  69.85,79.38 270 bottom
Q7  81.28,79.38 270 bottom
Q8  92.71,79.38 270 bottom
Q9  104.14,79.38 270 bottom
Q10  106.68,8.89 180 bottom
Q11  99.06,8.89 180 bottom
Q12  91.44,8.89 180 bottom
Q13  83.82,8.89 180 bottom
Q14  76.2,8.89 180 bottom
Q15  68.58,8.89 180 bottom
Q16  99.06,21.59 180 bottom
Q17  116.84,24.77 270 bottom
R1  21.59,12.7 180 bottom
R2  11.43,34.29 270 top
R3  40.64,40.01 0 top
R4  29.84,79.38 270 bottom
R5  27.3,79.38 270 bottom
R6  40.64,37.47 0 top
R7  41.27,79.38 270 bottom
R8  38.73,79.38 270 bottom
R9  113.03,24.77 90 bottom
R10  52.7,79.38 270 bottom
R11  50.16,79.38 270 bottom
R12  121.28,24.77 270 bottom
R13  64.14,79.38 270 bottom
R14  61.59,79.38 270 bottom
R15  116.84,27.94 0 bottom
R16  75.56,79.38 270 bottom
R17  73.03,79.38 270 bottom
R19  87,79.38 270 bottom
R20  84.45,79.38 270 bottom
R22  98.42,79.38 270 bottom
R23  95.89,79.38 270 bottom
R25  109.86,79.38 270 bottom
R26  107.31,79.38 270 bottom
R28  102.87,10.16 90 bottom
R29  106.68,12.7 180 bottom
R31  95.25,10.16 90 bottom
R32  99.06,12.7 180 bottom
R34  87.63,10.16 90 bottom
R35  91.44,12.7 180 bottom
R37  80.01,10.16 90 bottom
R38  83.82,12.7 180 bottom
R40  72.39,10.16 90 bottom
R41  76.2,12.7 180 bottom
R43  64.77,10.16 90 bottom
R44  68.58,12.7 180 bottom
R46  95.25,22.86 90 bottom
R47  99.06,25.4 180 bottom
R48  46.99,60.96 270 top
R49  74.93,60.96 270 top
R50  27.94,65.41 270 bottom
R51  30.48,65.41 270 top
R52  27.94,56.52 90 bottom
R53  25.4,56.52 90 top
R54  22.86,45.09 270 top
R55  22.86,73.03 90 bottom
R56  25.4,65.41 270 top
R57  30.48,48.9 270 bottom
R58  40.64,65.41 90 bottom
R59  43.18,65.41 90 top
R60  40.64,56.52 270 bottom
R61  35.56,56.52 270 top
R62  33.02,45.09 90 top
R63  38.1,73.03 270 bottom
R64  38.1,56.52 270 top
R65  43.18,48.9 90 bottom
R66  55.88,65.41 270 bottom
R67  58.42,65.41 270 top
R68  55.88,56.52 90 bottom
R69  53.34,56.52 90 top
R70  50.8,45.09 270 top
R71  50.8,73.03 90 bottom
R72  53.34,65.41 270 top
R73  58.42,48.9 270 bottom
R74  68.58,65.41 90 bottom
R75  71.12,65.41 90 top
R76  68.58,56.52 270 bottom
R77  63.5,56.52 270 top
R78  60.96,45.09 90 top
R79  66.04,73.03 270 bottom
R80  66.04,56.52 270 top
R81  71.12,48.9 90 bottom
R82  83.82,65.41 270 bottom
R83  86.36,65.41 270 top
R84  83.82,56.52 90 bottom
R85  81.28,56.52 90 top
R86  78.74,45.09 270 top
R87  78.74,73.03 90 bottom
R88  81.28,65.41 270 top
R89  86.36,48.9 270 bottom
R90  96.52,65.41 90 bottom
R91  99.06,65.41 90 top
R92  96.52,56.52 270 bottom
R93  91.44,56.52 270 top
R94  88.9,45.09 90 top
R95  93.98,73.03 270 bottom
R96  93.98,56.52 270 bottom
R97  99.06,48.9 90 bottom
R98  111.12,65.41 270 bottom
R99  113.67,65.41 270 top
R100  111.12,56.52 90 bottom
R101  106.05,56.52 90 top
R102  103.5,45.09 270 top
R103  106.05,73.03 90 bottom
R104  103.5,65.41 270 bottom
R105  113.67,48.9 270 bottom
REV  11.43,29.21 270 top
SECONDS  88.9,60.96 0 top
TEMP  127,52.07 0 top
TENS_SEC  108.58,60.96 0 top
U1  49.53,27.94 0 top
U$1  [ADILOGO]  21.59,83.82 0 bottom
U$2  [ADILOGO]  113,83 0 top
U$3  [ADILOGO]  21.56,4.26 0 top
UART  49.53,8.89 0 top
USB  3.81,16.51 270 top
X1  38.1,22.86 90 top

### Tracks (layer width: path | path; a pad name or v marks a point on that pad's centre or on a via)
+5V  (via drill 0.38 pad 0.81)
  Top 0.203: DIGIT_POS.10 v87,27.3 90.17,27.3 90.81,27.94 90.81,37.47 89.53,38.73 87.63,38.73 87,38.1 7_SEGMENT.10 | v79.38,23.5 DIGIT_POS.16 78.48,25.66 77.47,26.67 77.47,34.92 78.11,35.56 78.74,35.56 79.38,36.2 7_SEGMENT.16 79,37.47 75.56,37.47 74.3,36.2 v67.31,35.56 | 47.62,28.34 U1.4 42.27,28.34 33.15,37.47 | 47.62,28.34 49.13,28.34 49.93,27.54 U1.20 55.01,27.54 55.24,27.3 55.24,26.67 54.52,25.94 U1.18 53.92,26.04 54.61,26.04 55.24,25.4 55.24,15.88 53.34,13.97 ICSP.5 | 32,37.59 33.02,37.59 33.15,37.47 | 33.15,37.47 R6.1 R3.1 | v34.92,40.64 31.94,37.66 | U1.6 47.06,26.74 47.62,27.3 47.62,28.34
  Top 0.61: ON.3 8.13,68.58 12.83,60.07 12.83,45.34 20.07,38.1 31.5,38.1 31.94,37.66 32,37.59
  Bottom 0.203: Q2.3 23.03,80.81 24.13,81.92 33.02,81.92 34.29,80.64 34.29,79.55 Q3.3 34.46,80.81 35.56,81.92 44.45,81.92 45.72,80.64 45.72,79.55 Q4.3 45.89,80.81 46.99,81.92 55.88,81.92 57.15,80.64 57.15,79.55 Q5.3 57.32,80.81 58.42,81.92 67.31,81.92 68.58,80.64 68.58,79.55 Q6.3 68.75,80.81 69.85,81.92 | 69.85,81.92 78.74,81.92 80.01,80.64 80.01,79.55 Q7.3 80.18,80.81 81.28,81.92 90.17,81.92 91.44,80.64 91.44,79.55 Q8.3 91.61,80.81 92.71,81.92 101.6,81.92 102.87,80.64 102.87,79.55 Q9.3 | v87,27.3 87,22.23 | 87,22.23 80.64,22.23 v79.38,23.5 | LCD.2 66.04,36.83 | 66.04,36.83 v67.31,35.56 | BUZZER.+ 113.67,13.97 111.12,16.51 94.61,16.51 88.9,22.23 87,22.23 | 66.04,36.83 56.52,36.83 51.44,41.91 36.2,41.91 v34.92,40.64 | 69.85,81.92 68.58,83.19 DS3231.2
  Bottom 0.61: ON.3 3.81,69.22 13.97,79.38 Q2.3
  pour Top (isolate 0.254): 33.47,34.9 33.37,34.8 33.27,34.6 33.27,34.4 33.37,34.2 33.67,34.1 33.87,34.1 34.17,34.3 34.97,34.3 35.17,34.4 35.77,34.9 36.17,35.4 36.27,35.8 35.87,36.5 35.67,37.3 35.57,37.8 35.27,38.2 35.17,38.6 34.87,38.9 33.77,38.9 33.17,39.2 32.77,39.2 32.27,38.8 31.57,38.8 31.17,38.4 30.77,38.2 30.47,38.2 30.27,38 30.17,37.6 29.87,37 29.87,36.4 29.97,36.1 30.17,35.6 30.57,35.2 30.97,35.2 31.27,35.4 31.47,35.3 31.97,35.3 32.27,35.5 32.67,35.2 33.37,35.2 33.67,35.5 34.57,35.5 34.57,35.4 33.87,35.4
A  (via drill 0.38 pad 0.81)
  Top 0.203: v109.86,60.96 v98.42,60.96
  Bottom 0.203: 95.89,64.45 R82.2 R74.1 R66.2 R58.1 R50.2 27.62,64.77 22.86,64.77 20.32,67.31 20.32,74.3 21.59,75.56 23.5,75.56 25.23,77.3 Q2.2 | 95.89,64.45 R90.1 | R98.2 111.12,62.87 v109.86,60.96 | v98.42,60.96 96.52,62.87 96.52,63.82 95.89,64.45
B  (via drill 0.38 pad 0.81)
  Top 0.203: R51.2 R59.1 | R59.1 v43.18,62.23 | v58.42,62.23 R67.2 R75.1 v71.12,62.23 | v86.36,62.23 R83.2 R91.1 R99.2 | R59.1 44.13,64.45 45.09,65.41 45.09,69.22 43.81,70.48 40.64,70.48 40.01,71.12 40.01,74.3 38.73,75.56 37.47,75.56 v35.56,76.83
  Bottom 0.203: v43.18,62.23 v58.42,62.23 | v71.12,62.23 v86.36,62.23 | v35.56,76.83 36.83,78.25 Q3.2
BUZZER  (via drill 0.38 pad 0.81)
  Top 0.203: U1.1 43.44,30.74 v43.18,30.48 | v111.12,27.94 89.53,6.35 69.85,6.35 69.22,6.99 67.94,6.99 67.31,6.35 v43.18,6.35
  Bottom 0.203: v43.18,30.48 v43.18,6.35 | v111.12,27.94 R15.2
C  (via drill 0.38 pad 0.81)
  Top 0.203: v85.09,59.69 v95.25,59.69 | v109.86,59.69 v98.42,59.69 | v50.16,58.42 50.16,66.67 48.9,67.94 48.9,69.22 v48.26,76.83
  Bottom 0.203: R52.2 R60.1 R68.2 | R68.2 R76.1 R84.2 83.82,58.42 v85.09,59.69 | R92.1 97.16,57.47 96.68,57.94 | v95.25,59.69 95.25,59.37 96.68,57.94 | R100.2 111.12,58.42 v109.86,59.69 | v98.42,59.69 96.68,57.94 | R68.2 50.48,57.47 50.16,57.78 v50.16,58.42 | v48.26,76.83 48.26,78.25 Q4.2
D  (via drill 0.38 pad 0.81)
  Top 0.203: R53.2 R61.1 v35.56,59.69 | R101.2 R93.1 R85.2 v81.28,59.69 | v53.34,59.69 R69.2 R77.1 v63.5,59.69 | v59.69,76.2 59.69,74.93 61.59,73.03 69.85,73.03 73.03,69.85 v73.03,59.69
  Bottom 0.203: v35.56,59.69 v53.34,59.69 | v63.5,59.69 v73.03,59.69 v81.28,59.69 | Q5.2 59.52,76.37 v59.69,76.2
DP
  Bottom 0.203: R57.2 R65.1 R73.2 R81.1 R89.2 R97.1 R105.2 113.98,47.62 114.94,47.62 115.57,48.26 115.57,69.85 114.94,70.48 109.22,70.48 107.95,71.75 107.95,74.93 105.24,77.64 Q9.2
DS  (via drill 0.38 pad 0.81)
  Top 0.203: U1.23 69.31,29.94 v76.2,36.2 | v81.92,39.37 7_SEGMENT.14
  Bottom 0.203: v76.2,36.2 76.2,38.73 76.83,39.37 v81.92,39.37
E  (via drill 0.38 pad 0.81)
  Top 0.203: R54.2 R62.1 R70.2 R78.1 76.83,44.13 | R102.2 R94.1 R86.2 76.83,44.13 | v71.12,76.83 74.93,76.2 76.83,74.3 76.83,44.13
  Bottom 0.203: Q6.2 70.95,77 v71.12,76.83
F
  Bottom 0.203: 82.55,73.97 R87.2 R79.1 R71.2 R63.1 R55.2 | 82.55,73.97 R95.1 R103.2 | Q7.2 82.38,74.14 82.55,73.97
G  (via drill 0.38 pad 0.81)
  Top 0.203: R56.2 25.4,62.87 26.67,61.59 36.83,61.59 38.1,60.33 | 38.1,60.33 R64.1 | 38.1,60.33 38.73,60.96 v41.27,60.96 | v52.7,60.96 53.34,61.59 | 53.34,61.59 R72.2 | 53.34,61.59 53.98,60.96 64.77,60.96 66.04,59.69 | R80.1 66.04,59.69 | 66.04,59.69 v67.31,60.96 | v79.38,60.96 80.64,60.96 81.28,61.59 | 81.28,61.59 R88.2 | v92.08,60.96 81.92,60.96 81.28,61.59 | v93.98,60.96 95.89,62.23 v103.5,62.23 | v94.61,76.2 97.16,76.2 v101.6,71.75
  Bottom 0.203: v41.27,60.96 v52.7,60.96 | v67.31,60.96 v79.38,60.96 | v92.08,60.96 93.98,59.05 R96.1 v93.98,60.96 | v103.5,62.23 R104.2 103.19,64.14 102.23,64.14 101.6,64.77 v101.6,71.75 | Q8.2 93.81,77 v94.61,76.2
GND  (via drill 0.38 pad 0.81)  (51 unrouted)
  Bottom 0.203: R32.2 Q11.2 | Q12.2 R35.2 | Q13.2 R38.2 | R41.2 Q14.2 | R44.2 Q15.2 | R47.2 Q16.2
  other vias: 43.81,33.02 52.07,28.57 67.81,23.02 36.81,12.02 19.82,24.02
  pour Top (isolate 0.152, rank 2): 3.81,1.27 arc-90 1.27,5.08 1.27,85.98 arc-90 5.08,89.79 130.81,89.79 arc-90 133.35,87.25 133.35,3.81 arc-90 130.81,1.27
  pour Bottom (isolate 0.152): 3.81,1.27 arc-90 1.27,5.08 1.27,85.98 arc-90 5.08,89.79 130.81,89.79 arc-90 133.35,87.25 133.35,3.81 arc-90 130.81,1.27
GND1
  Top 0.203: REV.A 7.4,28.16 6.27,29.29 J1.2
  Bottom 0.61: Q1.4 11.43,7.62 3.81,15.24 J1.2
HOUR_1  (via drill 0.38 pad 0.81)
  Top 0.203: v18.41,66.67 18.41,69.85 20.32,71.75 32.38,71.75 33.02,71.12 HOURS.GND1
  Bottom 0.203: Q10.3 106.68,3.17 106.05,2.54 36.83,2.54 28.57,10.79 28.57,42.55 19.68,51.44 19.68,65.41 v18.41,66.67
HOUR_2  (via drill 0.38 pad 0.81)
  Top 0.203: HOURS.GND2 35.56,70.48 33.66,72.39 19.05,72.39 17.14,70.48 v17.14,65.41 | v27.94,9.53 29.21,8.26 31.11,8.26 36.83,2.54 97.16,2.54 v99.06,4.45
  Bottom 0.203: v17.14,65.41 19.05,63.5 19.05,51.44 27.94,42.55 v27.94,9.53 | v99.06,4.45 Q11.3
MIN_1  (via drill 0.38 pad 0.81)
  Top 0.203: MINUTE.GND1 60.96,71.75 v57.15,75.56 | v25.4,75.56 21.59,75.56 15.88,69.85 15.88,65.41 19.05,62.23 19.05,42.55 19.68,41.91 25.4,41.91 v26.67,40.64 | v26.67,11.43 27.3,10.79 29.21,10.79 36.83,3.17 90.81,3.17 v91.44,3.81
  Bottom 0.203: v57.15,75.56 49.53,75.56 48.9,74.93 40.01,74.93 39.37,75.56 37.47,75.56 36.83,74.93 26.04,74.93 v25.4,75.56 | v26.67,40.64 27.3,36.83 27.3,12.06 v26.67,11.43 | v91.44,3.81 Q12.3
MIN_2  (via drill 0.38 pad 0.81)
  Top 0.203: MINUTE.GND2 63.5,70.48 v57.15,76.83 | v27.3,76.2 26.67,76.83 22.23,76.83 15.24,69.85 15.24,65.41 18.41,62.23 18.41,42.55 19.68,41.27 24.13,41.27 v25.4,40.01 | v26.04,12.7 27.94,12.7 36.83,3.81 83.19,3.81 v83.82,4.45
  Bottom 0.203: v57.15,76.83 50.16,76.83 48.9,75.56 41.27,75.56 40.64,76.2 36.83,76.2 36.2,75.56 27.94,75.56 v27.3,76.2 | v25.4,40.01 25.4,38.1 26.67,36.83 26.67,13.34 v26.04,12.7 | v83.82,4.45 Q13.3
MISO
  Top 0.203: U1.16 52.33,16.77 ICSP.6
MOSI  (via drill 0.38 pad 0.81)
  Top 0.203: ICSP.3 50.8,15.24 50.8,18.41 51.53,19.14 U1.15 51.53,24.67 v50.8,25.4 | LED_SEC2.A 74.93,53.34 73.03,51.44 73.03,49.53 v68.58,45.09 | v54.61,45.09 54.61,48.26 v53.34,49.53 | v47.62,50.8 47.62,53.34 46.99,53.98 LED_SEC.A | v52.7,38.1 54.61,40.01 v54.61,43.36
  Bottom 0.203: v68.58,45.09 v54.61,45.09 v54.61,43.36 | v53.34,49.53 48.9,49.53 v47.62,50.8 | v50.8,25.4 50.8,29.21 50.16,29.84 50.16,35.56 v52.7,38.1
N$1
  Bottom 0.203: R1.2 22.54,10.45 Q1.1
N$2
  Top 0.203: LED_SEC.C R48.2
N$3
  Top 0.203: C4.2 37.72,28.07 X1.2 39.85,25.94 U1.7
N$4
  Top 0.203: U1.8 41.65,25.14 40.01,23.5 40.01,19.94 X1.1 37.21,18.92 C3.2
N$5
  Top 0.203: 7_SEGMENT.9 88.27,38.1 88.9,38.1 90.17,36.83 90.17,28.22 85.72,28.22 84.45,29.84 83.19,29.84 81.92,28.57 DIGIT_POS.14
N$6
  Bottom 0.203: Q2.1 R5.1 R4.1
N$7
  Top 0.203: R2.2 REV.C
N$8
  Bottom 0.203: Q3.1 R8.1 R7.1
N$9
  Bottom 0.203: Q4.1 R11.1 R10.1
N$10
  Bottom 0.203: Q5.1 R14.1 R13.1
N$11
  Bottom 0.203: Q6.1 R17.1 74.61,80.33 74.93,80.01 75.25,80.01 R16.1
N$12
  Bottom 0.203: Q7.1 R20.1 R19.1
N$13
  Bottom 0.203: Q8.1 R23.1 R22.1
N$14
  Bottom 0.203: Q9.1 R26.1 R25.1
N$15
  Bottom 0.203: R29.1 Q10.1 104.95,9.21 R28.1
N$16  (via drill 0.38 pad 0.81)
  Top 0.203: CLOCK.1 122.56,71.75 116.2,65.41 116.2,50.8 94.61,29.21 94.61,23.5 87.63,16.51 63.5,16.51 v57.78,19.68 | U1.12 49.13,21.08 v50.55,19.66
  Bottom 0.203: v57.78,19.68 v50.55,19.66
N$17  (via drill 0.38 pad 0.81)
  Top 0.203: TEMP.1 120.02,53.98 117.47,51.44 117.47,50.8 95.89,29.21 95.89,23.5 87.63,15.24 62.87,15.24 v59.05,11.43 | U1.11 48.33,25.33 48.26,25.4 46.99,25.4 45.09,23.5 45.09,18.41 43.18,16.51 43.18,13.97 46.35,10.79 52.7,10.79 v54.61,8.89
  Bottom 0.203: v59.05,11.43 56.52,8.89 v54.61,8.89
N$18  (via drill 0.38 pad 0.81)
  Top 0.203: DATE.1 118.11,62.87 116.84,61.59 116.84,50.8 95.25,29.21 95.25,23.5 87.63,15.88 v57.78,15.88 | v53.34,11.43 46.35,11.43 43.81,13.97 43.81,16.51 47.62,20.32 47.62,23.55 U1.10
  Bottom 0.203: v57.78,15.88 v53.34,11.43
N$19
  Bottom 0.203: R32.1 Q11.1 97.33,9.21 R31.1
N$20
  Top 0.203: R48.1 LED_SEC1.A
N$21
  Top 0.203: LED_SEC2.C R49.2
N$22
  Bottom 0.203: R12.1 Q17.1 117.79,25.86 R15.1
N$23
  Bottom 0.203: R35.1 Q12.1 89.71,9.21 R34.1
N$24
  Top 0.203: R49.1 LED_SEC3.A
N$25  (via drill 0.38)
  Top 0.203: U1.32 46.73,35.05 v47.75,36.07 | v51.82,40.13 52.32,40.13 v53.59,41.4 | v73.15,41.15 74.17,41.15 75.95,42.93 77.22,42.93 78.23,41.91 100.84,41.91 v102.11,40.64 | v106.68,36.07 108.84,36.07 ALARM_SET.1
  Bottom 0.203: v47.75,36.07 v51.82,40.13 | v53.59,41.4 72.9,41.4 v73.15,41.15 | v102.11,40.64 v106.68,36.07
N$26
  Bottom 0.203: R50.1 HOURS.A1
N$27
  Bottom 0.203: R38.1 Q13.1 82.09,9.21 R37.1
N$28
  Top 0.203: R51.1 HOURS.B1
N$29  (via drill 0.38)
  Top 0.203: U1.9 46.73,22.68 v45.95,21.89 | v44.04,21.01 44.04,19.91 41.91,17.78 v41.91,7.62 | v91.44,16.76 95.5,16.76 110.49,31.75 118.11,31.75 122.17,35.81 122.17,37.97 ALARM_ARM.1
  Bottom 0.203: v45.95,21.89 v44.04,21.01 | v41.91,7.62 41.91,6.1 42.93,5.08 55.12,5.08 62.74,12.7 62.74,13.72 67.82,18.8 89.41,18.8 v91.44,16.76
N$30
  Bottom 0.203: R52.1 HOURS.C1
N$31
  Bottom 0.203: R41.1 Q14.1 74.47,9.21 R40.1
N$32
  Top 0.203: R53.1 HOURS.D1
N$33
  Top 0.203: R54.1 HOURS.E1
N$34
  Bottom 0.203: R55.1 HOURS.F1
N$35
  Bottom 0.203: R44.1 Q15.1 66.85,9.21 R43.1
N$36
  Top 0.203: R56.1 HOURS.G1
N$37
  Bottom 0.203: R57.1 HOURS.DP1
N$38
  Bottom 0.203: R58.2 HOURS.A2
N$39
  Bottom 0.203: R47.1 Q16.1 97.33,21.91 R46.1
N$40
  Top 0.203: R59.2 HOURS.B2
N$41
  Bottom 0.203: R60.2 HOURS.C2
N$42
  Top 0.203: R61.2 HOURS.D2
N$43
  Top 0.203: R62.2 HOURS.E2
N$44
  Bottom 0.203: R63.2 HOURS.F2
N$45
  Top 0.203: R64.2 HOURS.G2
N$46
  Bottom 0.203: R65.2 HOURS.DP2
N$47
  Bottom 0.203: R74.2 MINUTE.A2
N$48
  Bottom 0.203: R66.1 MINUTE.A1
N$49
  Top 0.203: R67.1 MINUTE.B1
N$50
  Bottom 0.203: R68.1 MINUTE.C1
N$51
  Top 0.203: R75.2 MINUTE.B2
N$52
  Bottom 0.203: R76.2 MINUTE.C2
N$53
  Top 0.203: R77.2 MINUTE.D2
N$54
  Top 0.203: R78.2 MINUTE.E2
N$55
  Bottom 0.203: R79.2 MINUTE.F2
N$56
  Top 0.203: R80.2 MINUTE.G2
N$57
  Bottom 0.203: R81.2 MINUTE.DP2
N$58
  Bottom 0.203: R73.1 MINUTE.DP1
N$59
  Top 0.203: R72.1 MINUTE.G1
N$60
  Bottom 0.203: R71.1 MINUTE.F1
N$61
  Top 0.203: R70.1 MINUTE.E1
N$62
  Top 0.203: R69.1 MINUTE.D1
N$63
  Bottom 0.203: R9.2 114.79,25.71 Q17.3
N$64
  Bottom 0.203: R9.1 113.03,22.23 114.94,20.32 118.11,20.32 121.92,16.51 121.92,14.16 BUZZER.-
N$65
  Bottom 0.203: R89.1 SECONDS.DP1
N$66
  Top 0.203: R88.1 SECONDS.G1
N$67
  Bottom 0.203: R87.1 SECONDS.F1
N$68
  Top 0.203: R86.1 SECONDS.E1
N$75
  Bottom 0.203: R82.1 SECONDS.A1
N$76
  Top 0.203: SECONDS.B1 R83.1
N$77
  Bottom 0.203: R84.1 SECONDS.C1
N$78
  Top 0.203: R85.1 SECONDS.D1
N$79
  Bottom 0.203: R90.2 SECONDS.A2
N$80
  Top 0.203: R91.2 SECONDS.B2
N$81
  Bottom 0.203: R92.2 SECONDS.C2
N$82
  Top 0.203: SECONDS.D2 R93.2
N$83
  Top 0.203: R94.2 SECONDS.E2
N$84
  Bottom 0.203: R95.2 SECONDS.F2
N$85
  Bottom 0.203: SECONDS.G2 R96.2
N$86
  Bottom 0.203: R97.2 SECONDS.DP2
N$95
  Bottom 0.203: R98.1 TENS_SEC.A
N$96
  Top 0.203: R99.1 TENS_SEC.B
N$97
  Bottom 0.203: R100.1 TENS_SEC.C
N$98
  Top 0.203: R101.1 TENS_SEC.D
N$99
  Top 0.203: R102.1 TENS_SEC.E
N$100
  Bottom 0.203: TENS_SEC.F R103.1
N$101
  Bottom 0.203: R104.1 TENS_SEC.G
N$102
  Bottom 0.203: R105.1 TENS_SEC.DP
Q0.1  (via drill 0.38 pad 0.81)
  Top 0.203: 7_SEGMENT.15 v80.64,40.64 | v48.9,46.35 48.9,67.31 46.99,69.22 46.99,74.3 41.91,79.38 35.56,79.38 v33.02,76.83
  Bottom 0.203: v80.64,40.64 80.64,41.91 76.2,46.35 v48.9,46.35 | v33.02,76.83 30.48,76.83 29.84,77.47 R4.2
Q0.2  (via drill 0.38 pad 0.81)
  Top 0.203: DIGIT_POS.15 80.64,23.5 81.28,22.86 v92.08,22.86
  Bottom 0.203: R46.2 93.03,23.81 v92.08,22.86
Q1.1  (via drill 0.38 pad 0.81)
  Top 0.203: v46.35,46.35 46.35,53.34 45.09,54.61 45.09,64.14 45.72,64.77 45.72,72.39 v41.91,76.83 | v79.38,33.02 7_SEGMENT.1
  Bottom 0.203: v46.35,46.35 48.9,42.55 74.3,42.55 74.3,36.2 76.2,34.29 78.11,34.29 v79.38,33.02 | v41.91,76.83 41.91,77.79 R7.2
Q1.2  (via drill 0.38 pad 0.81)
  Top 0.203: DIGIT_POS.1 v79.38,17.78
  Bottom 0.203: R43.2 64.77,13.97 69.22,17.14 78.74,17.14 v79.38,17.78
Q2.1  (via drill 0.38 pad 0.81)
  Top 0.203: 7_SEGMENT.2 v80.64,33.66 | v73.66,45.09 73.66,50.8 76.2,53.34 76.2,68.58 67.94,76.83 66.67,76.83 64.14,79.38 v54.61,79.38
  Bottom 0.203: v80.64,33.66 80.01,33.66 78.74,34.92 76.2,34.92 74.93,36.2 74.93,44.45 v73.66,45.09 | v54.61,79.38 53.02,78.11 R10.2
Q2.2  (via drill 0.38 pad 0.81)
  Top 0.203: DIGIT_POS.2 v80.64,17.78
  Bottom 0.203: v80.64,17.78 79.38,16.51 74.93,16.51 72.39,13.97 R40.2
Q3.1  (via drill 0.38 pad 0.81)
  Top 0.203: 7_SEGMENT.3 81.92,29.84 v81.28,29.21 | v73.03,37.47 73.03,38.1 v76.2,41.27 | v78.11,55.88 v78.11,66.67 | v74.93,72.39 73.66,72.39 68.58,77.47 67.31,77.47 v66.67,78.11 | v75.56,45.09 v75.56,51.44
  Bottom 0.203: v81.28,29.21 78.74,29.21 75.56,32.38 75.56,34.29 73.03,36.83 v73.03,37.47 | v76.2,41.27 76.2,44.45 v75.56,45.09 | v78.11,55.88 75.56,53.34 v75.56,51.44 | v78.11,66.67 74.93,69.85 v74.93,72.39 | v66.67,78.11 64.45,78.11 R13.2
Q3.2  (via drill 0.38 pad 0.81)
  Top 0.203: DIGIT_POS.3 v81.92,17.78
  Bottom 0.203: v81.92,17.78 80.01,15.88 R37.2
Q4.1  (via drill 0.38 pad 0.81)
  Top 0.203: 7_SEGMENT.4 v83.19,33.66 | v100.97,46.35 100.97,54.61 v99.69,55.88 | v98.42,72.39 94.61,72.39 90.81,76.2 78.74,76.2 v78.11,76.83
  Bottom 0.203: v83.19,33.66 93.34,33.66 93.98,34.29 93.98,39.37 v100.97,46.35 | v99.69,55.88 99.69,62.23 100.97,63.5 100.97,69.85 v98.42,72.39 | v78.11,76.83 77.16,76.83 R16.2
Q4.2  (via drill 0.38 pad 0.81)
  Top 0.203: DIGIT_POS.4 v83.19,17.78
  Bottom 0.203: v83.19,17.78 87.63,13.34 R34.2
Q5.1  (via drill 0.38 pad 0.81)
  Top 0.203: 7_SEGMENT.5 84.45,30.48 85.09,29.84 85.72,29.84 v86.33,29.03 | v106.05,66.04 103.5,66.04 100.97,68.58 100.97,70.48 100.33,71.12 90.81,71.12 v87,74.93 | v105.41,50.16 106.68,48.9 106.68,43.18 v95.89,32.38
  Bottom 0.203: v86.33,29.03 90.78,29.03 v95.89,32.38 | v106.05,66.04 106.05,62.87 101.6,58.42 101.6,51.44 102.87,50.16 v105.41,50.16 | v87,74.93 R19.2
Q5.2  (via drill 0.38 pad 0.81)
  Top 0.203: DIGIT_POS.5 v84.45,17.78
  Bottom 0.203: v84.45,17.78 87.63,14.61 93.98,14.61 95.25,13.34 R31.2
Q6.1  (via drill 0.38 pad 0.81)
  Top 0.203: 7_SEGMENT.6 85.72,31.11 87,29.84 v88.27,29.84 | v99.69,76.2 103.5,72.39 113.67,72.39 115.57,70.48 115.57,50.8 95.89,31.11 94.61,31.11 v93.22,31.93
  Bottom 0.203: v99.69,76.2 99.69,77.16 R22.2 | v88.27,29.84 90.17,29.84 v93.22,31.93
Q6.2  (via drill 0.38 pad 0.81)
  Top 0.203: DIGIT_POS.6 v85.72,17.78
  Bottom 0.203: v85.72,17.78 87.63,15.88 100.33,15.88 102.87,13.34 R28.2
Q7.1  (via drill 0.38 pad 0.81)
  Top 0.203: 7_SEGMENT.7 v87.05,34.7 | v92.96,34.92 v95.25,34.92
  Bottom 0.203: v87.05,34.7 v92.96,34.92 | v95.25,34.92 95.25,39.37 102.87,46.99 109.86,46.99 110.49,46.35 114.94,46.35 116.84,48.26 116.84,70.48 112.39,74.93 110.49,74.93 109.86,75.56 R25.2
RESET  (via drill 0.38 pad 0.81)
  Top 0.203: U1.29 49.13,29.61 v49.53,29.21
  Bottom 0.203: v49.53,29.21 49.53,26.04 48.9,25.4 48.9,20.32 47.62,20.32 46.99,19.68 ICSP.2
RX  (via drill 0.38 pad 0.81)
  Top 0.203: U1.30 48.33,29.91 v48.26,29.84
  Bottom 0.203: v48.26,29.84 48.26,20.95 46.99,20.95 44.45,18.41 44.45,11.43 48.26,11.43 49.53,10.16 UART.2
SCK  (via drill 0.38 pad 0.81)
  Top 0.203: U1.17 53.82,21.74 v53.98,21.59
  Bottom 0.203: v53.98,21.59 51.44,21.59 49.53,20.32 ICSP.4
SCL  (via drill 0.38 pad 0.81)
  Top 0.203: v52.07,29.84 49.93,30.71 U1.28 49.93,37.06 49.53,37.47 R6.2 41.27,37.15 v41.27,34.29 | DS3231.4 63.5,83.19 62.87,82.55 34.29,82.55 31.11,79.38 22.23,79.38 12.7,69.85 12.7,65.41 15.88,62.23 15.88,50.8 v15.24,50.16 | v24.13,34.92 28.57,34.92 v30.48,33.02
  Bottom 0.203: v52.07,29.84 61.59,29.84 66.04,34.29 67.94,34.29 68.58,34.92 LCD.3 | v15.24,50.16 15.24,49.53 14.61,48.9 14.61,46.35 13.34,45.09 13.34,38.73 15.24,36.83 22.23,36.83 v24.13,34.92 | v30.48,33.02 40.01,33.02 v41.27,34.29
SDA  (via drill 0.38 pad 0.81)
  Top 0.203: LCD.4 71.12,37.47 70.48,36.83 62.23,36.83 61.59,36.2 52.07,36.2 50.73,34.85 U1.27 50.73,37.53 48.26,40.01 R3.2 41.91,40.33 41.91,41.27 40.64,42.55 21.59,42.55 20.32,43.81 v20.32,48.26 | DS3231.3 66.04,82.55 65.41,81.92 34.92,81.92 31.75,78.74 22.23,78.74 13.34,69.85 13.34,65.41 16.51,62.23 16.51,49.53 v15.88,48.9
  Bottom 0.203: v15.88,48.9 15.88,47.62 19.68,47.62 v20.32,48.26
SEC_1  (via drill 0.38 pad 0.81)
  Top 0.203: SECONDS.GND1 88.9,70.48 84.45,74.93 v80.64,74.93 | v61.59,75.56 61.59,76.83 60.33,78.11 44.45,78.11 42.55,80.01 34.29,80.01 31.75,77.47 22.23,77.47 14.61,69.85 14.61,65.41 17.78,62.23 17.78,42.55 19.68,40.64 22.86,40.64 v23.5,40.01 | v25.4,13.97 27.3,13.97 36.83,4.45 75.56,4.45 v76.2,5.08
  Bottom 0.203: v80.64,74.93 80.01,75.56 v61.59,75.56 | v23.5,40.01 23.5,39.37 26.04,36.83 26.04,14.61 v25.4,13.97 | v76.2,5.08 Q14.3
SEC_2  (via drill 0.38 pad 0.81)
  Top 0.203: v80.64,72.39 80.01,72.39 71.75,80.64 53.98,80.64 53.34,80.01 43.81,80.01 43.18,80.64 34.29,80.64 31.75,78.11 22.23,78.11 13.97,69.85 13.97,65.41 17.14,62.23 17.14,42.55 20.32,39.37 v22.23,39.37 | v24.77,15.24 26.67,15.24 36.83,5.08 67.94,5.08 v68.58,5.71
  Bottom 0.203: SECONDS.GND2 91.44,69.22 88.27,72.39 v80.64,72.39 | v22.23,39.37 22.86,38.1 23.5,38.1 25.4,36.2 25.4,15.88 v24.77,15.24 | v68.58,5.71 Q15.3
SHCP  (via drill 0.38 pad 0.81)
  Top 0.203: 7_SEGMENT.11 85.72,38.1 86.36,39.37 89.53,39.37 91.44,37.47 91.44,26.04 89.53,24.13 85.72,24.13 DIGIT_POS.11 v85.72,27.3 | U1.24 54.2,31.11 v67.31,31.11
  Bottom 0.203: v67.31,31.11 71.12,27.3 v85.72,27.3
STCP  (via drill 0.38 pad 0.81)
  Top 0.203: 7_SEGMENT.12 84.45,38.1 85.72,40.01 89.53,40.01 92.08,37.47 92.08,26.04 89.53,23.5 84.45,23.5 DIGIT_POS.12 v84.45,28.57 | U1.25 52.48,32.38 v67.31,32.38
  Bottom 0.203: v67.31,32.38 71.75,27.94 83.82,27.94 v84.45,28.57
TENS  (via drill 0.38 pad 0.81)
  Top 0.203: v108.58,49.53 v108.58,45.72
  Bottom 0.203: TENS_SEC.GND1 TENS_SEC.GND v108.58,49.53 | v108.58,45.72 107.95,27.3 100.97,20.32 99.23,20.32 Q16.3
TX  (via drill 0.38 pad 0.81)
  Top 0.203: U1.31 47.53,30.39 v46.99,29.84
  Bottom 0.203: v46.99,29.84 46.99,21.59 43.81,18.41 43.81,10.79 46.35,10.79 46.99,10.16 UART.1
VCC  (via drill 0.38 pad 0.81)
  Top 0.203: J1.1 6.35,34.29 7.62,35.56 11.11,35.56 R2.1 11.75,35.56 12.7,35.56 v13.97,33.02
  Bottom 0.203: R1.1 17.78,12.7 13.97,15.24 v13.97,33.02
  Bottom 0.61: BYPASS_REG.2 7.36,39.63 IC2.1 6.61,39.63 3.81,36.83 J1.1 7.62,34.29 8.89,35.56 C1.1
VCC_1
  Top 0.457: USB.1 6.49,24.27 8.89,26.67 13.97,26.67 15.24,27.94 15.24,36.83 12.7,39.37 8.89,39.37 7.62,40.64 7.62,44.45 6.35,45.72 BYPASS_REG.1
  Bottom 0.61: ON.2 ON.1 BYPASS_REG.1 8.91,45.72 IC2.2 | C2.1 10.03,44.6
  Bottom 1.016: 10.03,44.6 IC2.2

### Text on the board
tPlace: SCL | SDA | VCC | GND | GND | GND | VCC | SCL | SDA
bPlace: View mode: clock / date / temperature / config | Setting clock: / - from clock mode press CLOCK (first press will config HH, next MM, next SS) / - in this mode DATE / TEMP buttons are used as UP / DOWN for setting the clock / - after setting the SS, pressing CLOCK will save and exit the config mode | Setting alarm: / - press ALARM_SET button / - CLOCK, DATE, TEMP buttons are used in the same way as setting clock / - pressing ALARM_ARM, will set the alarm ON or OFF / (dot point in TENS_SEC digit will be on when the alarm is armed)
tNames: 7-12V